# EAGLE design MCB-Wise-1530-v2.0.0 (EAGLE 7.7.0)

## Sheet 1 of 2
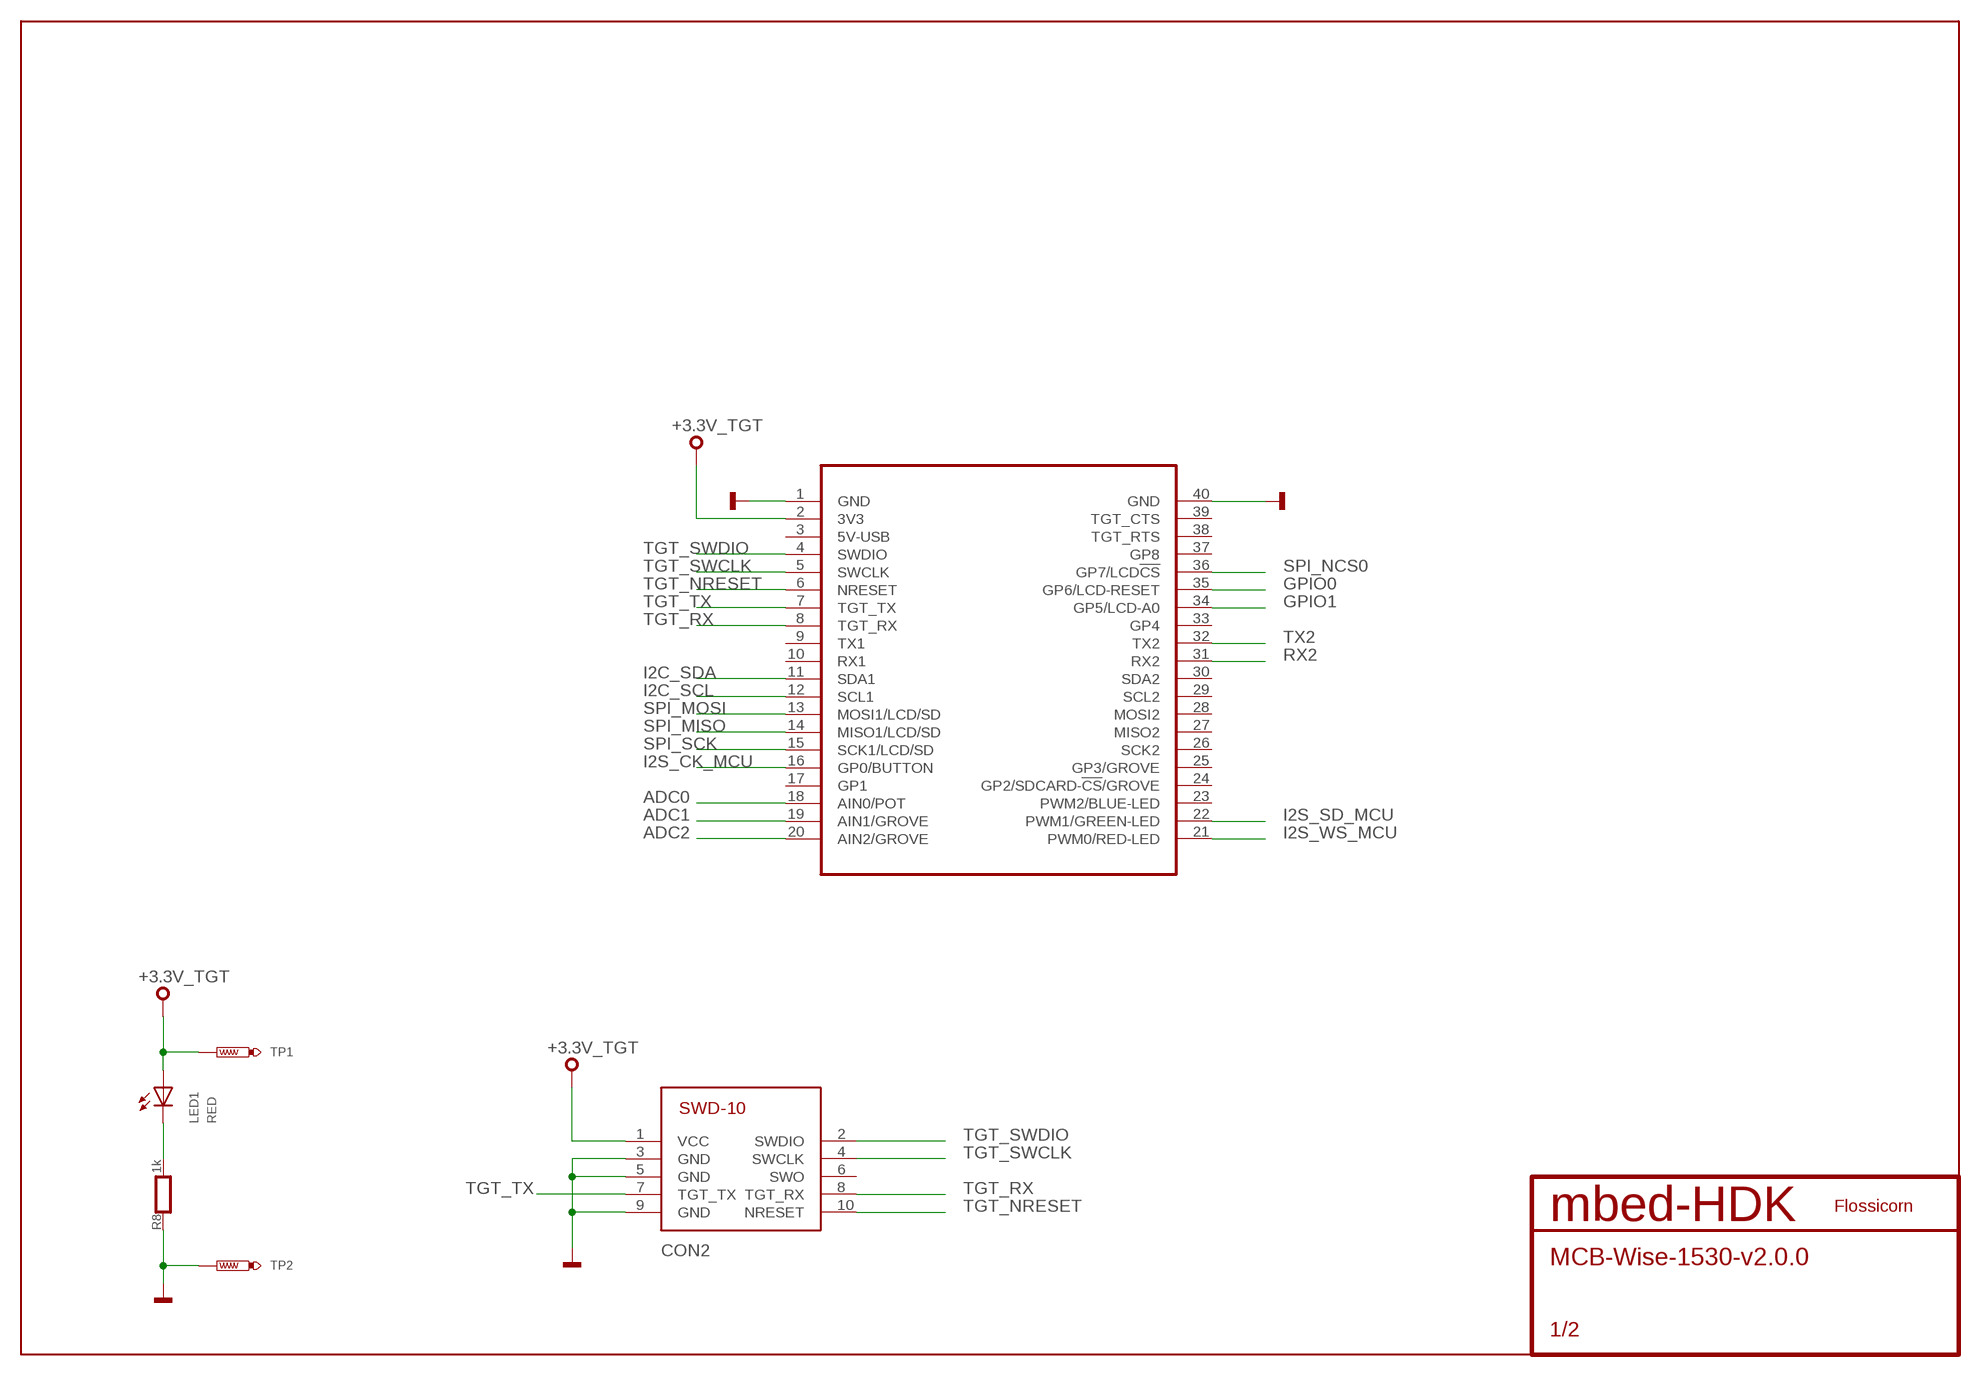
[diagram p0: schematic, sheet 1]

### Parts
CON2  SWD-10/TC2050_SMD  [FTSH-105-02]
LED1  RED  SMD_LED0603  [CHIPLED_0603]
MOD2  MODULE_DAUGHTER  [MODULE_DAUGHTER]
R8  1k  RESISTOR0603  [0603]
SS1  FLOSSICORN0.25  [FLOSSICORN-0.25]
TP1  TEST-POINT-50R-PTH  [TP50-PTH]
TP2  TEST-POINT-50R-PTH  [TP50-PTH]

### Nets
+3.3V_TGT: CON2.1(VCC) LED1.A MOD2.2(3V3) TP1.TP ; also sheet 2
ADC0: MOD2.18(AIN0/POT) ; also sheet 2
ADC1: MOD2.19(AIN1/GROVE) ; also sheet 2
ADC2: MOD2.20(AIN2/GROVE) ; also sheet 2
GND: CON2.3(GND) CON2.5(GND) CON2.9(GND) MOD2.1(GND) MOD2.40(GND) R8.1 TP2.TP ; also sheet 2
GPIO0: MOD2.35(GP6/LCD-RESET) ; also sheet 2
GPIO1: MOD2.34(GP5/LCD-A0) ; also sheet 2
I2C_SCL: MOD2.12(SCL1) ; also sheet 2
I2C_SDA: MOD2.11(SDA1) ; also sheet 2
I2S_CK_MCU: MOD2.16(GP0/BUTTON) ; also sheet 2
I2S_SD_MCU: MOD2.22(PWM1/GREEN-LED) ; also sheet 2
I2S_WS_MCU: MOD2.21(PWM0/RED-LED) ; also sheet 2
PA_1: LED1.C R8.2
RX2: MOD2.31(RX2) ; also sheet 2
SPI_MISO: MOD2.14(MISO1/LCD/SD) ; also sheet 2
SPI_MOSI: MOD2.13(MOSI1/LCD/SD) ; also sheet 2
SPI_NCS0: MOD2.36(GP7/LCD!CS) ; also sheet 2
SPI_SCK: MOD2.15(SCK1/LCD/SD) ; also sheet 2
TGT_NRESET: CON2.10(NRESET) MOD2.6(NRESET) ; also sheet 2
TGT_RX: CON2.8(TGT_RX) MOD2.8(TGT_RX) ; also sheet 2
TGT_SWCLK: CON2.4(SWCLK) MOD2.5(SWCLK) ; also sheet 2
TGT_SWDIO: CON2.2(SWDIO) MOD2.4(SWDIO) ; also sheet 2
TGT_TX: CON2.7(TGT_TX) MOD2.7(TGT_TX) ; also sheet 2
TX2: MOD2.32(TX2) ; also sheet 2
Unconnected: CON2.6(SWO) MOD2.3(5V-USB) MOD2.9(TX1) MOD2.10(RX1) MOD2.17(GP1) MOD2.23(PWM2/BLUE-LED) MOD2.24(GP2/SDCARD-!CS!/GROVE) MOD2.25(GP3/GROVE) MOD2.26(SCK2) MOD2.27(MISO2) MOD2.28(MOSI2) MOD2.29(SCL2) MOD2.30(SDA2) MOD2.33(GP4) MOD2.37(GP8) MOD2.38(TGT_RTS) MOD2.39(TGT_CTS)

## Sheet 2 of 2
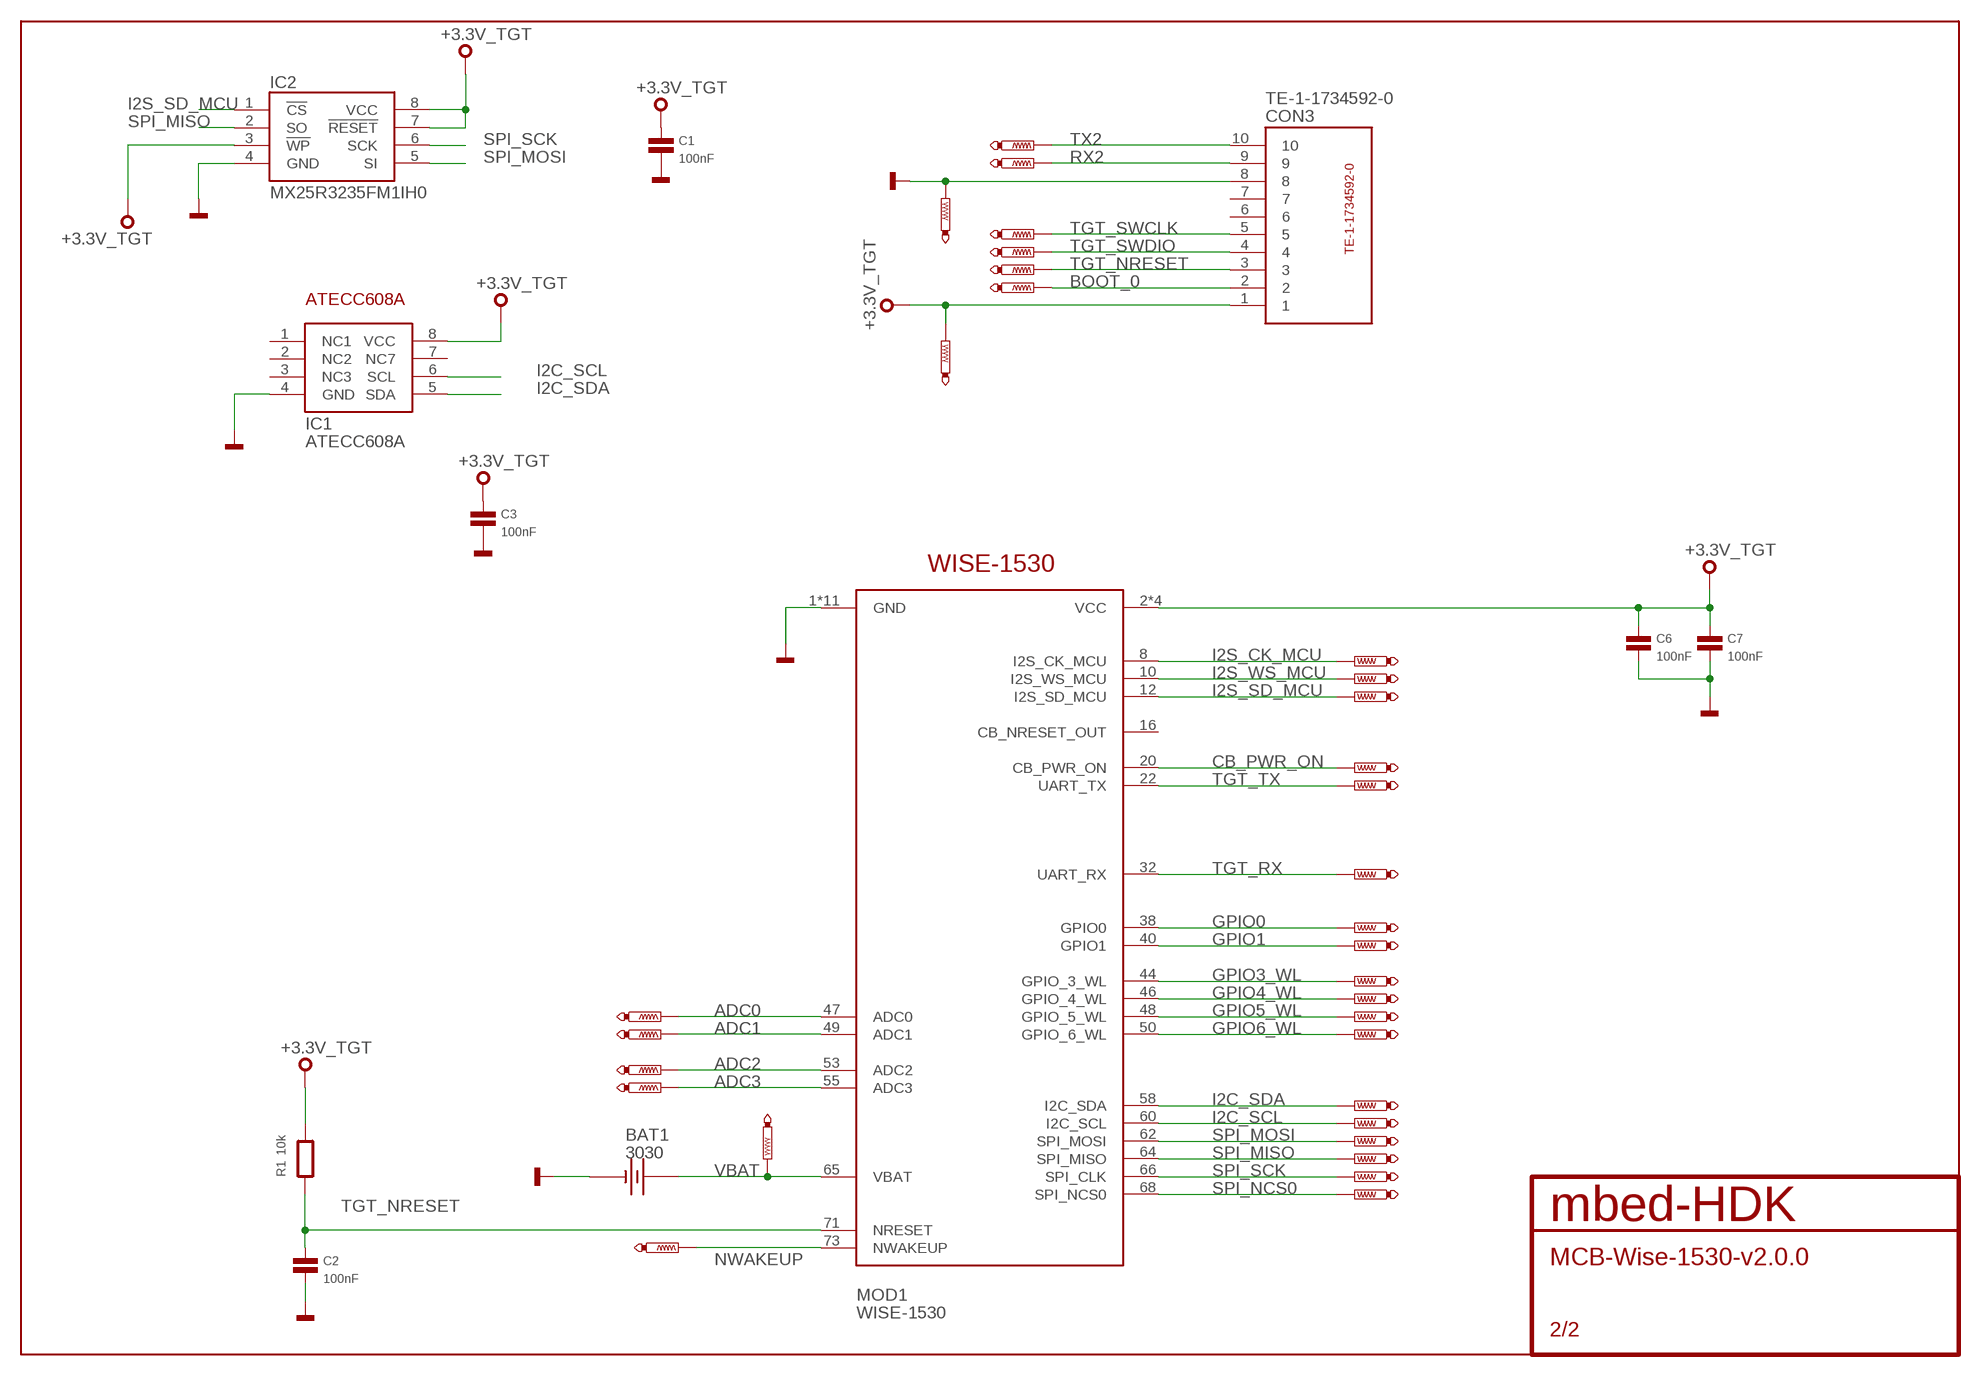
[diagram p1: schematic, sheet 2]

### Parts
BAT1  3030  [3030]
C1  100nF  CAPACITOR0603  [0603]
C2  100nF  CAPACITOR0603  [0603]
C3  100nF  CAPACITOR0603  [0603]
C6  100nF  CAPACITOR0603  [0603]
C7  100nF  CAPACITOR0603  [0603]
CON3  TE-1-1734592-0  [TE-1-1734592-0]
IC1  ATECC608A  [SO8]
IC2  MX25R3235FM1IH0  [SO8]
MOD1  WISE-1530  [MDT420E02001]
R1  10k  RESISTOR0603  [0603]
TP3  PTR1TP08R  [TP08R]
TP4  PTR1TP08R  [TP08R]
TP5  PTR1TP08R  [TP08R]
TP6  PTR1TP08R  [TP08R]
TP7  PTR1TP08R  [TP08R]
TP8  PTR1TP08R  [TP08R]
TP9  PTR1TP07R  [TP07R]
TP10  PTR1TP07R  [TP07R]
TP11  PTR1TP07R  [TP07R]
TP12  PTR1TP08R  [TP08R]
TP13  PTR1TP08R  [TP08R]
TP14  PTR1TP07R  [TP07R]
TP15  PTR1TP07R  [TP07R]
TP16  PTR1TP07R  [TP07R]
TP17  PTR1TP07R  [TP07R]
TP18  PTR1TP07R  [TP07R]
TP19  PTR1TP07R  [TP07R]
TP20  PTR1TP07R  [TP07R]
TP21  PTR1TP07R  [TP07R]
TP22  PTR1TP07R  [TP07R]
TP23  PTR1TP07R  [TP07R]
TP24  PTR1TP07R  [TP07R]
TP25  PTR1TP07R  [TP07R]
TP26  PTR1TP07R  [TP07R]
TP27  PTR1TP07R  [TP07R]
TP28  PTR1TP07R  [TP07R]
TP29  PTR1TP07R  [TP07R]
TP30  PTR1TP07R  [TP07R]
TP31  PTR1TP07R  [TP07R]
TP32  PTR1TP07R  [TP07R]
TP33  PTR1TP07R  [TP07R]
TP34  PTR1TP07R  [TP07R]

### Nets
+3.3V_TGT: C1.1 C3.1 C6.1 C7.1 CON3.1 IC1.8(VCC) IC2.3(!WP) IC2.7(!RESET) IC2.8(VCC) MOD1.2(VCC) MOD1.4(VCC) MOD1.72(VCC) MOD1.74(VCC) R1.2 TP12.TP ; also sheet 1
ADC0: MOD1.47(ADC0) TP29.TP ; also sheet 1
ADC1: MOD1.49(ADC1) TP30.TP ; also sheet 1
ADC2: MOD1.53(ADC2) TP31.TP ; also sheet 1
ADC3: MOD1.55(ADC3) TP32.TP
BOOT_0: CON3.2 TP8.TP
CB_PWR_ON: MOD1.20(CB_PWR_ON) TP14.TP
GND: BAT1.- C1.2 C2.2 C3.2 C6.2 C7.2 CON3.8 IC1.4(GND) IC2.4(GND) MOD1.1(GND) MOD1.7(GND) MOD1.18(GND) MOD1.33(GND) MOD1.39(GND) MOD1.45(GND) MOD1.51(GND) MOD1.57(GND) MOD1.63(GND) MOD1.69(GND) MOD1.75(GND) TP13.TP ; also sheet 1
GPIO0: MOD1.38(GPIO0) TP27.TP ; also sheet 1
GPIO1: MOD1.40(GPIO1) TP26.TP ; also sheet 1
GPIO3_WL: MOD1.44(GPIO_3_WL) TP25.TP
GPIO4_WL: MOD1.46(GPIO_4_WL) TP24.TP
GPIO5_WL: MOD1.48(GPIO_5_WL) TP23.TP
GPIO6_WL: MOD1.50(GPIO_6_WL) TP22.TP
I2C_SCL: IC1.6(SCL) MOD1.60(I2C_SCL) TP20.TP ; also sheet 1
I2C_SDA: IC1.5(SDA) MOD1.58(I2C_SDA) TP21.TP ; also sheet 1
I2S_CK_MCU: MOD1.8(I2S_CK_MCU) TP9.TP ; also sheet 1
I2S_SD_MCU: IC2.1(!CS) MOD1.12(I2S_SD_MCU) TP11.TP ; also sheet 1
I2S_WS_MCU: MOD1.10(I2S_WS_MCU) TP10.TP ; also sheet 1
NWAKEUP: MOD1.73(NWAKEUP) TP34.TP
RX2: CON3.9 TP6.TP ; also sheet 1
SPI_MISO: IC2.2(SO) MOD1.64(SPI_MISO) TP18.TP ; also sheet 1
SPI_MOSI: IC2.5(SI) MOD1.62(SPI_MOSI) TP19.TP ; also sheet 1
SPI_NCS0: MOD1.68(SPI_NCS0) TP16.TP ; also sheet 1
SPI_SCK: IC2.6(SCK) MOD1.66(SPI_CLK) TP17.TP ; also sheet 1
TGT_NRESET: C2.1 CON3.3 MOD1.71(NRESET) R1.1 TP5.TP ; also sheet 1
TGT_RX: MOD1.32(UART_RX) TP28.TP ; also sheet 1
TGT_SWCLK: CON3.5 TP3.TP ; also sheet 1
TGT_SWDIO: CON3.4 TP4.TP ; also sheet 1
TGT_TX: MOD1.22(UART_TX) TP15.TP ; also sheet 1
TX2: CON3.10 TP7.TP ; also sheet 1
VBAT: BAT1.+1(+) BAT1.+2(+) MOD1.65(VBAT) TP33.TP
Unconnected: CON3.6 CON3.7 IC1.1(NC1) IC1.2(NC2) IC1.3(NC3) IC1.7(NC7) MOD1.16(CB_NRESET_OUT)

## Library data of the parts
BAT1 = mbed-HDK-Connector:3030: CR927, CR1025 Battery Holder for 9-10mm Cells-Tin Nickel Plated SMD; MF: Keystone; MFN: 3030; OC-DIGIKEY: 36-3030-ND; OC-MOUSER: 534-3030; OC-NEWARK: 39T8899
C1-C3 C6 C7 = mbed-HDK-RLC:CAPACITOR: Capacitor
CON2 = mbed-HDK-Connector:SWD-10/TC2050: 1mm pitch 10-Pin Cortex Programming Header with optional TC2050 footprint solderless interchangeable
CON3 = blackbriar:TE-1-1734592-0
IC1 = blackbriar:ATECC608A
IC2 = mbed-HDK-IC:MX25R3235FM1IH0: Serial Flash 32 Mb 80 Mhz; MF: Macronix; MFN: MX25R3235FM1IH0; OC-DIGIKEY: 1092-1175-ND
LED1 = mbed-HDK-Optical:SMD_LED: LED SMD, Colour Red; MF: Wurth Electronics Inc; MFN: 150060RS75000; OC-DIGIKEY: 732-4978-1-ND; OC-MOUSER: 710-150060RS75000; OC-NEWARK: 2322071
MOD1 = blackbriar:WISE-1530
MOD2 = blackbriar:MODULE_DAUGHTER
R1 R8 = mbed-HDK-RLC:RESISTOR: Resistor
SS1 = blackbriar:FLOSSICORN
TP1 TP2 = mbed-HDK:TEST-POINT
TP3-TP34 = blackbriar:PTR1: TEST PIN

## Board
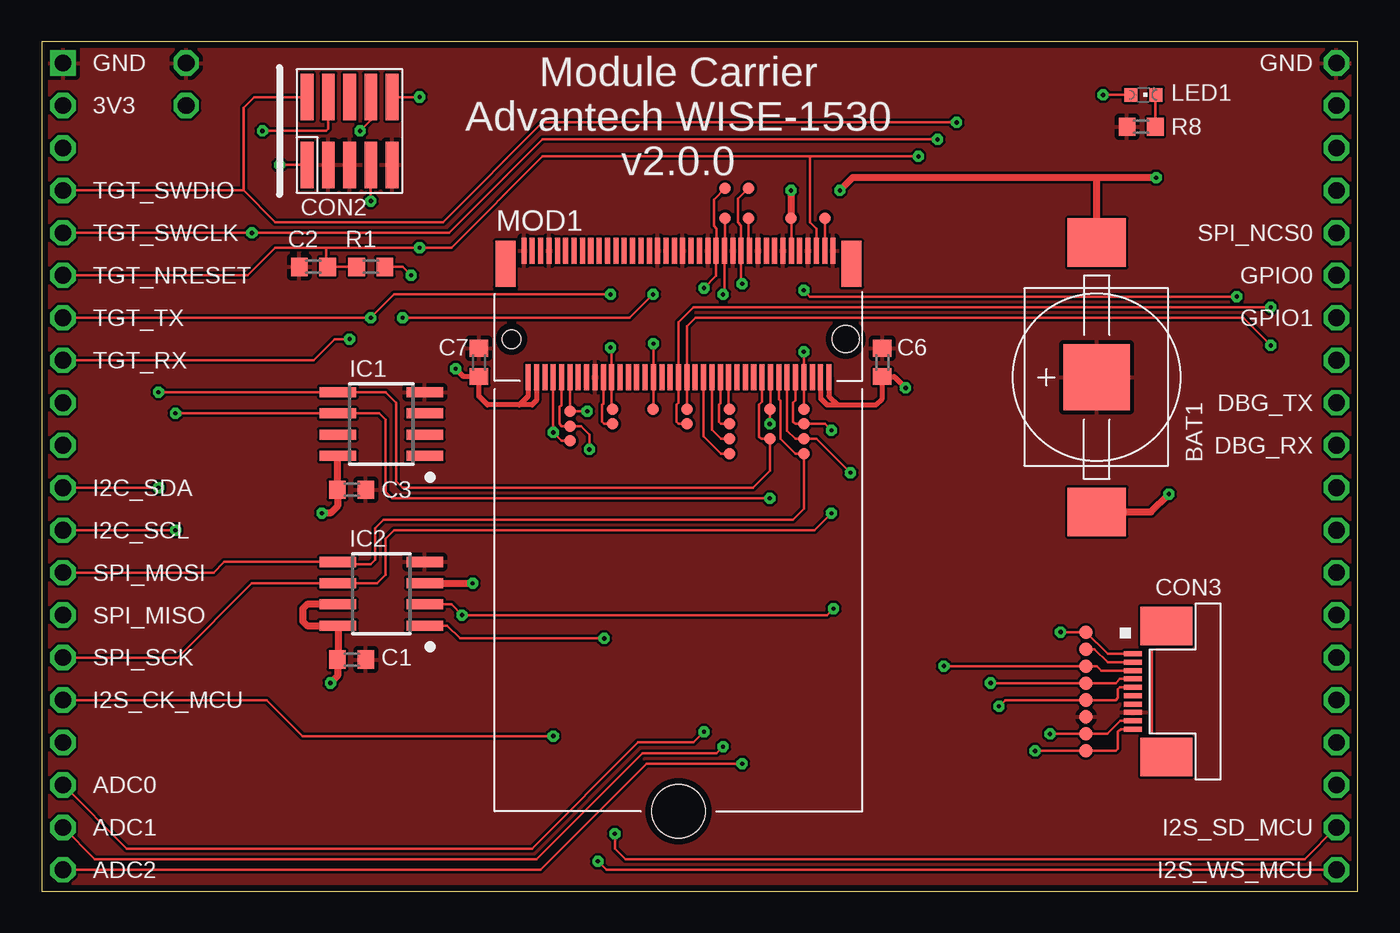
[diagram p2: board, top side]
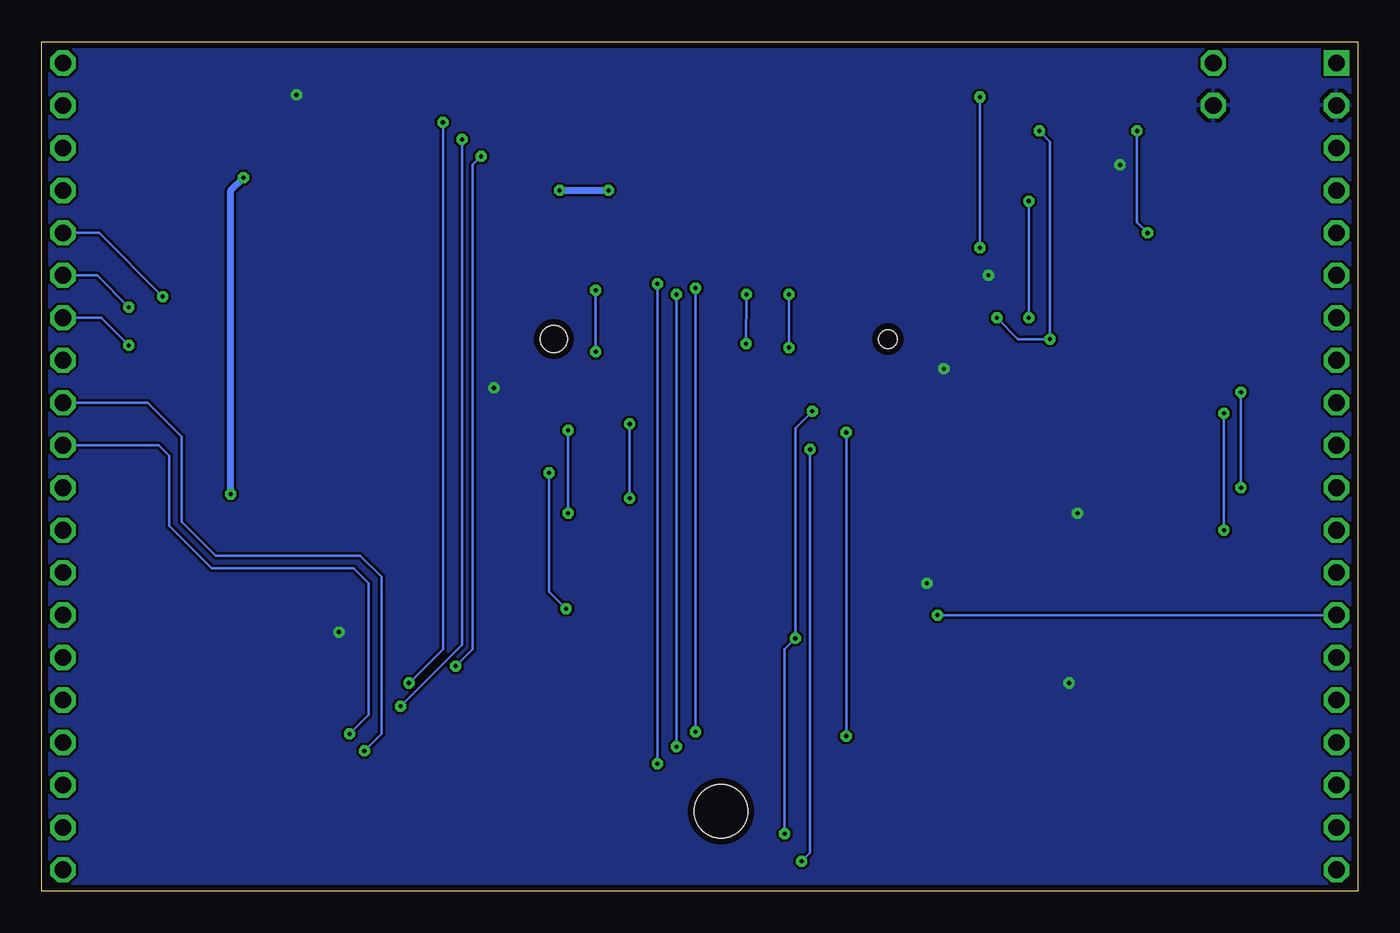
[diagram p3: board, bottom side, seen from below]

Size 78.74 x 50.8 mm. Coordinates in mm from the lower left corner, seen from the top.
Copper layers ((1*16)): Top 0.035mm / dielectric 0.8mm / Bottom 0.035mm
Design rules "mbed-HDK-6-6-2-layer": minimum track width 6mil, minimum drill 9mil, track to track 6mil, track to pad 6mil, pad to pad 6mil, via to via 6mil, smd to smd 6mil, copper to edge 15mil, drill to drill 8mil, minimum pad ring 10mil, minimum via ring 8mil, stop-mask expansion 4mil, vias tented up to drill 0mil, thermal gap 10mil

### Footprints (pad centres in the part's own frame; a part is rotated, then mirrored left to right if it is on the bottom)
3030 = smd 2.9 x 3.5: +1 8.05,0; +2 -8.05,0 | smd 3.96 x 3.96: - 0,0
0603 = smd 1 x 1.1: 1 -0.85,0; 2 0.85,0
FTSH-105-02 = smd 0.762 x 2.794: 1 0.381,-2.032; 2 0.381,2.032; 3 1.651,-2.032; 4 1.651,2.032; 5 2.921,-2.032; 6 2.921,2.032; 7 4.191,-2.032; 8 4.191,2.032; 9 5.461,-2.032; 10 5.461,2.032
TE-1-1734592-0 = smd 0.3 x 1.1: 1 2.25,0.5; 2 1.75,0.5; 3 1.25,0.5; 4 0.75,0.5; 5 0.25,0.5; 6 -0.25,0.5; 7 -0.75,0.5; 8 -1.25,0.5; 9 -1.75,0.5; 10 -2.25,0.5 | smd 2.3 x 3.1: P$1 -3.92,-1.5; P$2 3.92,-1.5
SO8 = smd 0.6 x 2.2: 1 -1.905,-2.6; 2 -0.635,-2.6; 3 0.635,-2.6; 4 1.905,-2.6; 5 1.905,2.6; 6 0.635,2.6; 7 -0.635,2.6; 8 -1.905,2.6
CHIPLED_0603 = smd 0.8 x 0.8: A 0,-0.75; C 0,0.75
MDT420E02001 = smd 0.3 x 1.55: 1 -9.25,5.275; 2 -9,-2.275; 3 -8.75,5.275; 4 -8.5,-2.275; 5 -8.25,5.275; 6 -8,-2.275; 7 -7.75,5.275; 8 -7.5,-2.275; 9 -7.25,5.275; 10 -7,-2.275; 11 -6.75,5.275; 12 -6.5,-2.275; 13 -6.25,5.275; 14 -6,-2.275; 15 -5.75,5.275; 16 -5.5,-2.275; 17 -5.25,5.275; 18 -5,-2.275; 19 -4.75,5.275; 20 -4.5,-2.275; 21 -4.25,5.275; 22 -4,-2.275; 23 -3.75,5.275; 24 -3.5,-2.275; 25 -3.25,5.275; 26 -3,-2.275; 27 -2.75,5.275; 28 -2.5,-2.275; 29 -2.25,5.275; 30 -2,-2.275; 31 -1.75,5.275; 32 -1.5,-2.275; 33 -1.25,5.275; 34 -1,-2.275; 35 -0.75,5.275; 36 -0.5,-2.275; 37 -0.25,5.275; 38 0,-2.275; 39 0.25,5.275; 40 0.5,-2.275; 41 0.75,5.275; 42 1,-2.275; 43 1.25,5.275; 44 1.5,-2.275; 45 1.75,5.275; 46 2,-2.275; 47 2.25,5.275; 48 2.5,-2.275; 49 2.75,5.275; 50 3,-2.275; 51 3.25,5.275; 52 3.5,-2.275; 53 3.75,5.275; 54 4,-2.275; 55 4.25,5.275; 56 4.5,-2.275; 57 4.75,5.275; 58 5,-2.275; 59 5.25,5.275; 60 5.5,-2.275; 61 5.75,5.275; 62 6,-2.275; 63 6.25,5.275; 64 6.5,-2.275; 65 6.75,5.275; 66 7,-2.275; 67 7.25,5.275; 68 7.5,-2.275; 69 7.75,5.275; 70 8,-2.275; 71 8.25,5.275; 72 8.5,-2.275; 73 8.75,5.275; 74 9,-2.275; 75 9.25,5.275 | smd 1.2 x 2.75: H1 -10.35,4.5; H2 10.35,4.5 | hole 1.1: -10,0 | hole 1.6: 10,0 | hole 3.2: 0,-28.25
MODULE_DAUGHTER = drill 1 square: 1 0,0 | drill 1 octagon: 2 0,-2.54; 3 0,-5.08; 4 0,-7.62; 5 0,-10.16; 6 0,-12.7; 7 0,-15.24; 8 0,-17.78; 9 0,-20.32; 10 0,-22.86; 11 0,-25.4; 12 0,-27.94; 13 0,-30.48; 14 0,-33.02; 15 0,-35.56; 16 0,-38.1; 17 0,-40.64; 18 0,-43.18; 19 0,-45.72; 20 0,-48.26; 21 76.2,-48.26; 22 76.2,-45.72; 23 76.2,-43.18; 24 76.2,-40.64; 25 76.2,-38.1; 26 76.2,-35.56; 27 76.2,-33.02; 28 76.2,-30.48; 29 76.2,-27.94; 30 76.2,-25.4; 31 76.2,-22.86; 32 76.2,-20.32; 33 76.2,-17.78; 34 76.2,-15.24; 35 76.2,-12.7; 36 76.2,-10.16; 37 76.2,-7.62; 38 76.2,-5.08; 39 76.2,-2.54; 40 76.2,0
TP50-PTH = drill 1 octagon: TP 0,0
TP08R = smd 0.8 x 0.8: TP 0,0
TP07R = smd 0.7 x 0.7: TP 0,0

### Placement (x,y rotation side)
BAT1  63.12,30.73 90 top
C1  18.54,13.84 0 top
C2  16.26,37.34 180 top
C3  18.54,24 0 top
C6  50.29,31.62 90 top
C7  26.16,31.62 90 top
CON2  15.49,45.47 0 top
CON3  65.79,11.94 90 top
IC1  20.32,27.94 90 top
IC2  20.32,17.78 90 top
LED1  65.91,47.62 270 top
MOD1  38.1,33.02 0 top
MOD2  1.27,49.53 0 top
R1  19.68,37.34 0 top
R8  65.79,45.72 0 top
SS1  44.83,5.21 0 top
TP1  8.64,46.99 0 top
TP2  8.64,49.53 0 top
TP3  62.48,11.43 180 top
TP4  62.48,12.45 180 top
TP5  62.48,13.46 180 top
TP6  62.48,9.4 180 top
TP7  62.48,8.38 180 top
TP8  62.48,14.48 180 top
TP9  31.62,26.92 270 top
TP10  31.62,27.81 270 top
TP11  31.62,28.7 270 top
TP12  62.48,15.49 180 top
TP13  62.48,10.41 180 top
TP14  34.16,27.94 270 top
TP15  34.16,28.83 270 top
TP16  45.59,28.83 270 top
TP17  45.59,27.94 270 top
TP18  45.59,27.05 270 top
TP19  45.59,26.16 270 top
TP20  43.56,28.83 270 top
TP21  43.56,27.05 270 top
TP22  41.15,28.83 270 top
TP23  41.15,27.94 270 top
TP24  41.15,27.05 270 top
TP25  41.15,26.16 270 top
TP26  38.61,28.83 270 top
TP27  38.61,27.94 270 top
TP28  36.58,28.83 270 top
TP29  40.89,42.04 270 top
TP30  40.89,40.26 270 top
TP31  42.29,42.04 270 top
TP32  42.29,40.26 270 top
TP33  44.83,40.26 270 top
TP34  46.86,40.26 270 top

### Tracks (layer width: path | path; a pad name or v marks a point on that pad's centre or on a via)
+3.3V_TGT  (via drill 0.25)
  Top 0.152: CON3.1 63.79,14.19 TP12.TP v60.96,15.49 | R1.2 21.59,37.34 v22.1,36.83 | CON2.1 v14.22,43.43 | LED1.A v63.5,47.62
  Top 0.305: MOD1.4 29.6,29.35 29.34,29.08 28.57,29.08 | MOD1.2 29.1,29.61 28.57,29.08 | v24.77,31.24 25.23,30.77 C7.1 26.16,29.59 26.67,29.08 28.57,29.08 | MOD1.72 46.6,29.47 46.99,29.08 47.62,29.08 | 47.62,29.08 49.91,29.08 50.29,29.46 C6.1 51.02,30.77 v51.69,30.1 | MOD1.74 47.1,29.61 47.62,29.08
  Top 0.406: v16.76,22.61 17.27,22.61 17.69,23.03 C3.1 17.69,26.01 IC1.8 | v17.27,12.45 17.69,12.87 C1.1 17.72,13.87 IC2.8 15.88,15.88 15.62,16.13 15.62,16.89 15.88,17.14 IC2.7 | IC2.3 v25.78,18.41
  pour Bottom: 0,0 78.74,0 78.74,50.8 0,50.8
ADC0  (via drill 0.25)
  Top 0.152: TP29.TP 40.22,41.37 40.22,39.79 40.39,39.62 40.39,38.86 MOD1.47 40.35,36.79 v39.62,36.07 | MOD2.18 5.08,2.54 29.34,2.54 35.69,8.89 38.99,8.89 v39.62,9.53
  Bottom 0.152: v39.62,9.53 v39.62,36.07
ADC1  (via drill 0.25)
  Top 0.152: TP30.TP 40.89,38.3 MOD1.49 40.85,35.77 v40.77,35.69 | MOD2.19 3.17,1.91 29.59,1.91 35.94,8.26 40.39,8.26 v40.77,8.64
  Bottom 0.152: v40.77,8.64 v40.77,35.69
ADC2  (via drill 0.25)
  Top 0.152: TP31.TP 41.66,41.4 41.66,40.01 41.85,39.81 MOD1.53 41.85,36.38 v41.91,36.32 | MOD2.20 29.84,1.27 36.2,7.62 v41.91,7.62
  Bottom 0.152: v41.91,7.62 v41.91,36.32
ADC3
  Top 0.152: MOD1.55 42.29,38.3 TP32.TP
BOOT_0
  Top 0.152: CON3.2 63.78,13.69 62.99,14.48 TP8.TP
CB_PWR_ON
  Top 0.152: MOD1.20 33.6,29.16 33.53,29.08 33.53,28.07 33.66,27.94 TP14.TP
GND
  pour Top: 0,0 78.74,0 78.74,50.8 0,50.8
GPIO0  (via drill 0.25)
  Top 0.152: TP27.TP 38.1,27.94 37.97,28.07 37.97,29.08 38.1,29.21 MOD1.38 38.1,34.04 38.99,34.92 v73.53,34.92
  Bottom 0.152: MOD2.35 75.44,36.83 v73.53,34.92
GPIO1  (via drill 0.25)
  Top 0.152: TP26.TP MOD1.40 38.61,33.78 39.12,34.29 71.88,34.29 v73.53,32.64
  Bottom 0.152: v73.53,32.64 75.18,34.29 MOD2.34
GPIO3_WL
  Top 0.152: MOD1.44 39.6,27.2 40.64,26.16 TP25.TP
GPIO4_WL
  Top 0.152: MOD1.46 40.1,27.59 40.64,27.05 TP24.TP
GPIO5_WL
  Top 0.152: MOD1.48 40.6,29.17 40.51,29.08 40.51,28.07 40.64,27.94 TP23.TP
GPIO6_WL
  Top 0.152: MOD1.50 41.1,28.88 TP22.TP
I2C_SCL  (via drill 0.25)
  Top 0.152: MOD1.60 43.6,28.87 TP20.TP v43.56,27.94 | MOD2.12 v8,21.59 | v8,28.57 IC1.6 20.19,28.57 20.57,28.19 20.57,23.88 20.95,23.5 v43.56,23.5
  Bottom 0.152: v8,21.59 v8,28.57 | v43.56,27.94 v43.56,23.5
I2C_SDA  (via drill 0.25)
  Top 0.152: MOD1.58 43.1,29.26 42.93,29.08 42.93,27.18 43.05,27.05 TP21.TP 43.56,25.15 42.55,24.13 21.59,24.13 21.21,24.51 21.21,29.21 20.57,29.84 IC1.5 v6.99,29.84 | MOD2.11 v6.99,24.13
  Bottom 0.152: v6.99,24.13 v6.99,29.84
I2S_CK_MCU  (via drill 0.25)
  Top 0.152: MOD1.8 v30.6,27.44 v30.61,27.43 31.11,26.92 TP9.TP | MOD2.16 13.46,11.43 15.62,9.27 v30.61,9.27
  Bottom 0.152: v30.61,9.27 v30.61,27.43 v30.6,27.44
I2S_SD_MCU  (via drill 0.25)
  Top 0.152: MOD1.12 31.6,28.73 TP11.TP v32.64,28.7 | MOD2.22 75.56,1.91 34.92,1.91 34.29,2.54 v34.29,3.43 | IC2.1 24.26,15.88 25.02,15.11 v33.66,15.11
  Bottom 0.152: v34.29,3.43 34.29,14.48 v33.66,15.11 33.66,27.69 v32.64,28.7
I2S_WS_MCU  (via drill 0.25)
  Top 0.152: MOD1.10 31.1,29.07 30.99,28.96 30.99,27.94 31.11,27.81 TP10.TP 32.26,27.81 32.77,27.3 v32.77,26.42 | MOD2.21 33.78,1.27 v33.27,1.78
  Bottom 0.152: v32.77,26.42 32.77,2.29 v33.27,1.78
N$6
  Top 0.152: 66.42,9.53 66.42,14.35
NWAKEUP
  Top 0.152: MOD1.73 46.85,40.25 TP34.TP
PA_1
  Top 0.152: R8.2 66.64,47.6 LED1.C
RX2  (via drill 0.25)
  Top 0.152: CON3.9 64.54,10.19 63.75,9.4 TP6.TP v60.33,9.4
  Bottom 0.152: MOD2.31 71.75,26.67 71.12,26.04 71.12,21.84 68.58,19.3 60.07,19.3 59.18,18.41 59.18,10.54 v60.33,9.4
SPI_MISO  (via drill 0.25)
  Top 0.152: MOD1.64 44.6,27.54 45.09,27.05 TP18.TP 46.35,27.05 v48.39,25.02 | IC2.2 24.51,17.14 v25.15,16.51 46.99,16.51 v47.37,16.89
  Bottom 0.152: MOD2.14 v25.15,16.51 | v48.39,25.02 48.39,17.91 v47.37,16.89
SPI_MOSI
  Top 0.152: MOD1.62 44.1,29.43 44.2,29.34 44.2,27.05 45.09,26.16 TP19.TP 45.59,22.86 44.96,22.23 20.45,22.23 19.94,21.72 19.94,19.81 19.68,19.56 18.29,19.56 | MOD2.13 10.29,19.05 10.92,19.68 IC2.5 | IC2.5 18.16,19.68 18.29,19.56 | 18.29,19.56 17.85,19.56 IC2.5
SPI_NCS0  (via drill 0.25)
  Top 0.152: TP16.TP MOD1.68 v45.6,32.25 v45.59,32.26 | v71.5,35.56 45.97,35.56 v45.59,35.94
  Bottom 0.152: MOD2.36 75.31,39.37 v71.5,35.56 | v45.59,32.26 v45.59,35.94
SPI_SCK  (via drill 0.25)
  Top 0.152: MOD1.66 45.1,29.35 44.96,29.21 44.96,28.07 45.09,27.94 TP17.TP 46.86,27.94 v47.24,27.56 | MOD2.15 8.13,13.97 12.57,18.41 IC2.6 20.07,18.41 20.57,18.92 20.57,21.08 21.08,21.59 46.23,21.59 v47.24,22.61
  Bottom 0.152: v47.24,22.61 v47.24,27.56
TGT_NRESET  (via drill 0.25)
  Top 0.152: CON3.3 63.39,13.19 63.12,13.46 TP5.TP v53.98,13.46 | MOD2.6 12.32,36.83 13.97,38.48 17.02,38.48 | 17.02,38.48 v22.61,38.48 24.51,38.48 29.97,43.94 45.97,43.94 | v22.61,47.5 CON2.10 | R1.1 C2.1 17.02,37.43 17.02,38.48 | 45.97,43.94 v52.45,43.94 | MOD1.71 46.35,39.63 45.97,40.01 45.97,43.94
  Bottom 0.152: v22.61,38.48 v22.61,47.5 | v52.45,43.94 52.96,43.43 52.96,14.48 v53.98,13.46
TGT_RX  (via drill 0.25)
  Top 0.152: TP28.TP 36.6,28.85 MOD1.32 v36.6,32.74 | MOD2.8 16.26,31.75 17.53,33.02 v18.41,33.02 | CON2.8 19.68,46.1 v19.05,45.47 | v21.59,34.29 35.18,34.29 v36.58,35.69
  Bottom 0.152: v19.05,45.47 18.41,44.83 v18.41,33.02 20.32,33.02 v21.59,34.29 | v36.6,32.74 v36.58,35.69
TGT_SWCLK  (via drill 0.25)
  Top 0.152: CON3.5 64.51,12.19 64.39,12.06 64.39,11.56 64.26,11.43 TP3.TP 57.66,11.43 v57.28,11.05 | MOD2.5 v12.57,39.37 24.38,39.37 29.97,44.96 v53.59,44.96 | CON2.4 17.14,45.59 17.02,45.47 v13.21,45.47
  Bottom 0.152: v13.21,45.47 13.21,40.01 v12.57,39.37 | v53.59,44.96 53.59,14.73 v57.28,11.05
TGT_SWDIO  (via drill 0.25)
  Top 0.152: CON3.4 64.5,12.69 64.26,12.45 TP4.TP v56.77,12.45 | MOD2.4 12.06,41.91 | 12.06,41.91 13.97,40.01 24,40.01 29.97,45.97 v54.74,45.97 | 12.06,41.91 12.06,46.86 12.7,47.5 CON2.2
  Bottom 0.152: v54.74,45.97 54.74,14.48 v56.77,12.45
TGT_TX  (via drill 0.25)
  Top 0.152: TP15.TP 34.1,28.89 MOD1.22 34.1,32.45 v34.04,32.51 | MOD2.7 v19.68,34.29 21.08,35.69 v34.04,35.69 | CON2.7 v19.68,41.27
  Bottom 0.152: v19.68,41.27 v19.68,34.29 | v34.04,35.69 v34.04,32.51
TX2  (via drill 0.25)
  Top 0.152: CON3.10 64.55,9.69 64.39,9.53 64.39,8.51 64.26,8.38 TP7.TP v59.44,8.38
  Bottom 0.152: MOD2.32 72.39,29.21 70.36,27.18 70.36,22.1 68.33,20.07 59.69,20.07 58.42,18.8 58.42,9.4 v59.44,8.38
VBAT  (via drill 0.25)
  Top 0.152: MOD1.65 44.85,40.24 TP33.TP
  Top 0.406: BAT1.+2 66.37,22.68 v67.44,23.75 | v66.67,42.67 62.99,42.67 | BAT1.+1 63.12,42.55 62.99,42.67 | 62.99,42.67 48.51,42.67 v47.75,41.91 | v44.83,41.91 TP33.TP
  Bottom 0.406: v67.44,23.75 67.44,41.91 v66.67,42.67 | v47.75,41.91 v44.83,41.91

### Text on the board
tPlace: GND / 3V3 / / TGT_SWDIO / TGT_SWCLK / TGT_NRESET / TGT_TX / TGT_RX / / / I2C_SDA / I2C_SCL / SPI_MOSI / SPI_MISO / SPI_SCK / I2S_CK_MCU / / ADC0 / ADC1 / ADC2 | GND / / / / SPI_NCS0 / GPIO0 / GPIO1 / / DBG_TX / DBG_RX / / / / / / / / / I2S_SD_MCU / I2S_WS_MCU | Module Carrier / Advantech WISE-1530 / v2.0.0